# EAGLE schematic Breadboard (EAGLE 9.6.2)
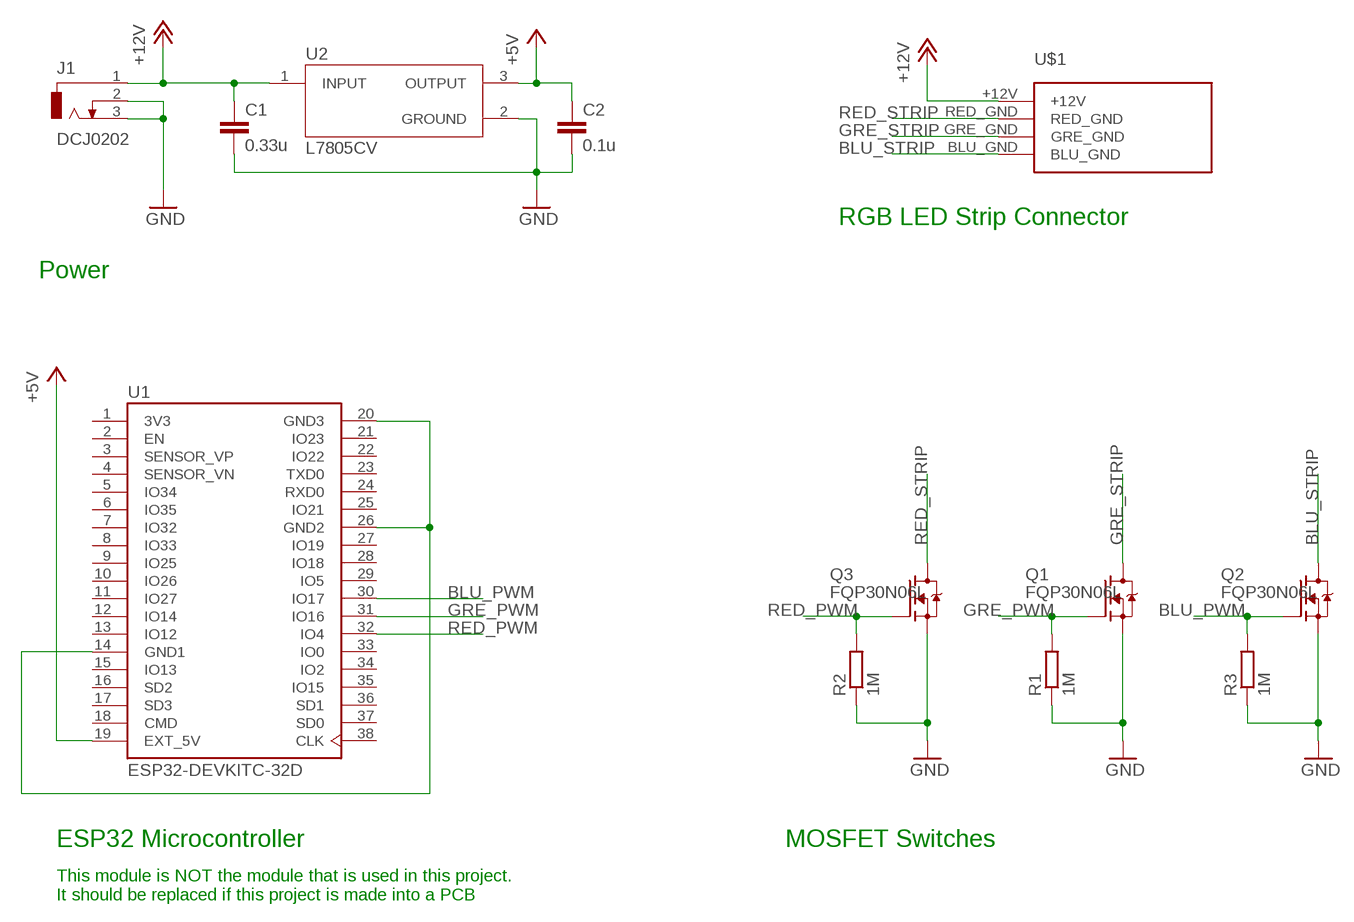
[diagram p0: schematic, sheet 1]

## Parts
C1  0.33u  C-EU050-025X075  [C050-025X075]
C2  0.1u  C-EU050-025X075  [C050-025X075]
J1  DCJ0202  [DCJ0202]
Q1  FQP30N06L  [TO220V]
Q2  FQP30N06L  [TO220V]
Q3  FQP30N06L  [TO220V]
R1  1M  R-EU_0411/12  [0411/12]
R2  1M  R-EU_0411/12  [0411/12]
R3  1M  R-EU_0411/12  [0411/12]
U1  ESP32-DEVKITC-32D  [MODULE_ESP32-DEVKITC-32D]
U2  L7805CV  [TO255P1040X460X1968-3]
U$1  RGB_LED_STRIP_COM_ANNODE  [RGB_LED_STRIP_COM_ANNODE]

## Nets
+5V: C2.1 U1.19(EXT_5V) U2.3(OUTPUT)
+12V: C1.1 J1.1 U2.1(INPUT) U$1.+12V
BLU_PWM: Q2.1(G) R3.2 U1.30(IO17)
BLU_STRIP: Q2.2(D) U$1.BLU_GND
GND: C1.2 C2.2 J1.2 J1.3 Q1.3(S) Q2.3(S) Q3.3(S) R1.1 R2.1 R3.1 U2.2(GROUND)
GRE_PWM: Q1.1(G) R1.2 U1.31(IO16)
GRE_STRIP: Q1.2(D) U$1.GRE_GND
N$2: U1.14(GND1) U1.20(GND3) U1.26(GND2)
RED_PWM: Q3.1(G) R2.2 U1.32(IO4)
RED_STRIP: Q3.2(D) U$1.RED_GND
Unconnected: U1.2(EN) U1.3(SENSOR_VP) U1.4(SENSOR_VN) U1.5(IO34) U1.6(IO35) U1.7(IO32) U1.8(IO33) U1.9(IO25) U1.10(IO26) U1.11(IO27) U1.12(IO14) U1.13(IO12) U1.15(IO13) U1.16(SD2) U1.17(SD3) U1.18(CMD) U1.21(IO23) U1.22(IO22) U1.23(TXD0) U1.24(RXD0) U1.25(IO21) U1.27(IO19) U1.28(IO18) U1.29(IO5) U1.33(IO0) U1.34(IO2) U1.35(IO15) U1.36(SD1) U1.37(SD0) U1.38(CLK)

## Notes on the sheet
- RGB LED Strip Connector
- Power
- ESP32 Microcontroller | MOSFET Switches
- This module is NOT the module that is used in this project.
  It should be replaced if this project is made into a PCB

## Power pins joined to a net without a drawn wire
3V3: U1.1(3V3)

## Library data of the parts
C1 C2 = rcl:C-EU: CAPACITOR, European symbol; SPICEPREFIX: C
J1 = con-jack:DCJ0202: DC POWER JACK Source: DCJ0202.pdf; OC_FARNELL: unknown; OC_NEWARK: unknown
Q1-Q3 = FQP30N06L:FQP30N06L: N-Channel QFET® MOSFET Source: Data Sheet Check prices <https://snapeda.com/parts/FQP30N06L/ON%20Semiconductor/view-part/?ref=eda>; ARROW_ELECTRONICS-PURCHASE-URL: https://snapeda.com/shop?store=Arrow+Electronics&id=1413126; AVAILABILITY: Good; DESCRIPTION: N-Channel 60V 32A (Tc) 79W (Tc) Through Hole TO-220-3; DIGIKEY-PURCHASE-URL: https://snapeda.com/shop?store=DigiKey&id=1413126; MF: ON Semiconductor; MOUSER-PURCHASE-URL: https://snapeda.com/shop?store=Mouser&id=1413126; MP: FQP30N06L; PACKAGE: TO-220 ON Semiconductor; PRICE: None
R1-R3 = rcl:R-EU_: RESISTOR, European symbol; SPICEPREFIX: R
U1 = ESP32-DEVKITC-32D:ESP32-DEVKITC-32D: Eval Board For Esp-Wroom-32 Check prices <https://snapeda.com/parts/ESP32-DEVKITC-32D/Espressif%20Systems/view-part/?ref=eda>; AVAILABILITY: Warning; DESCRIPTION: - Transceiver; 802.11 b/g/n (Wi-Fi, WiFi, WLAN), Bluetooth® Smart Ready 4.x Dual Mode For Use With ESP-WROOM-32; DIGIKEY-PURCHASE-URL: https://snapeda.com/shop?store=DigiKey&id=2777395; MF: Espressif Systems; MOUSER-PURCHASE-URL: https://snapeda.com/shop?store=Mouser&id=2777395; MP: ESP32-DEVKITC-32D; PACKAGE: None; PRICE: None
U2 = L7805CV:L7805CV: Standard Regulator Pos 5V 1.5A 3-Pin(3+Tab) TO-220 Standard Regulator Pos 5V 1.5A 3-Pin(3+Tab) TO-220 Check prices <https://snapeda.com/parts/L7805CV/STMicroelectronics/view-part/?ref=eda>; AVAILABILITY: Good; DESCRIPTION: Linear Voltage Regulator IC 1 Output 1.5A TO-220; DIGIKEY-PURCHASE-URL: https://snapeda.com/shop?store=DigiKey&id=501150; MF: STMicroelectronics; MOUSER-PURCHASE-URL: https://snapeda.com/shop?store=Mouser&id=501150; MP: L7805CV; PACKAGE: TO-220 STMicroelectronics; PRICE: None
U$1 = RGB_LED_STRIP:RGB_LED_STRIP_COM_ANNODE